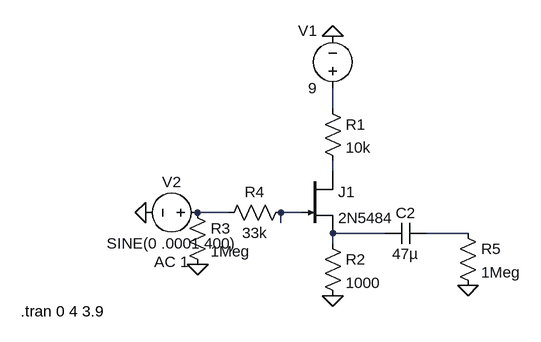
[diagram p0: schematic cathode follower.asc]
cathode follower.asc, the LTspice schematic file:
Version 4
SHEET 1 880 680
WIRE 160 0 160 -32
WIRE 160 96 160 80
WIRE 0 160 -48 160
WIRE 112 160 80 160
WIRE 80 176 80 160
WIRE 240 192 160 192
WIRE 368 192 304 192
WIRE 160 208 160 192
FLAG 160 -112 0
FLAG 160 288 0
FLAG -128 160 0
FLAG -48 240 0
FLAG 368 272 0
SYMBOL njf 112 96 R0
SYMATTR InstName J1
SYMATTR Value 2N5484
SYMBOL voltage 160 -16 R180
WINDOW 0 24 104 Left 0
WINDOW 3 24 16 Left 0
WINDOW 123 0 0 Left 0
WINDOW 39 0 0 Left 0
SYMATTR InstName V1
SYMATTR Value 9
SYMBOL res 144 -16 R0
SYMATTR InstName R1
SYMATTR Value 10k
SYMBOL res 144 192 R0
SYMATTR InstName R2
SYMATTR Value 1000
SYMBOL voltage -32 160 R90
WINDOW 0 -32 56 VBottom 0
WINDOW 3 32 56 VTop 0
WINDOW 123 60 56 VTop 0
WINDOW 39 0 0 Left 0
SYMATTR InstName V2
SYMATTR Value SINE(0 .0001 400)
SYMATTR Value2 AC 1
SYMBOL res -64 144 R0
SYMATTR InstName R3
SYMATTR Value 1Meg
SYMBOL res 96 144 R90
WINDOW 0 0 56 VBottom 0
WINDOW 3 32 56 VTop 0
SYMATTR InstName R4
SYMATTR Value 33k
SYMBOL cap 304 176 R90
WINDOW 0 0 32 VBottom 0
WINDOW 3 32 32 VTop 0
SYMATTR InstName C2
SYMATTR Value 47µ
SYMBOL res 352 176 R0
SYMATTR InstName R5
SYMATTR Value 1Meg
TEXT -320 312 Left 0 !.tran 0 4 3.9

The netlist it stands for:
* cathode follower.asc
J1 N002 N004 N005 2N5484
V1 N001 0 9
R1 N001 N002 10k
R2 N005 0 1000
V2 N003 0 SINE(0 .0001 400) AC 1
R3 N003 0 1Meg
R4 N004 N003 33k
C2 N006 N005 47µ
R5 N006 0 1Meg
.model NJF NJF
.model PJF PJF
.lib standard.jft
.tran 0 4 3.9
.backanno
.end